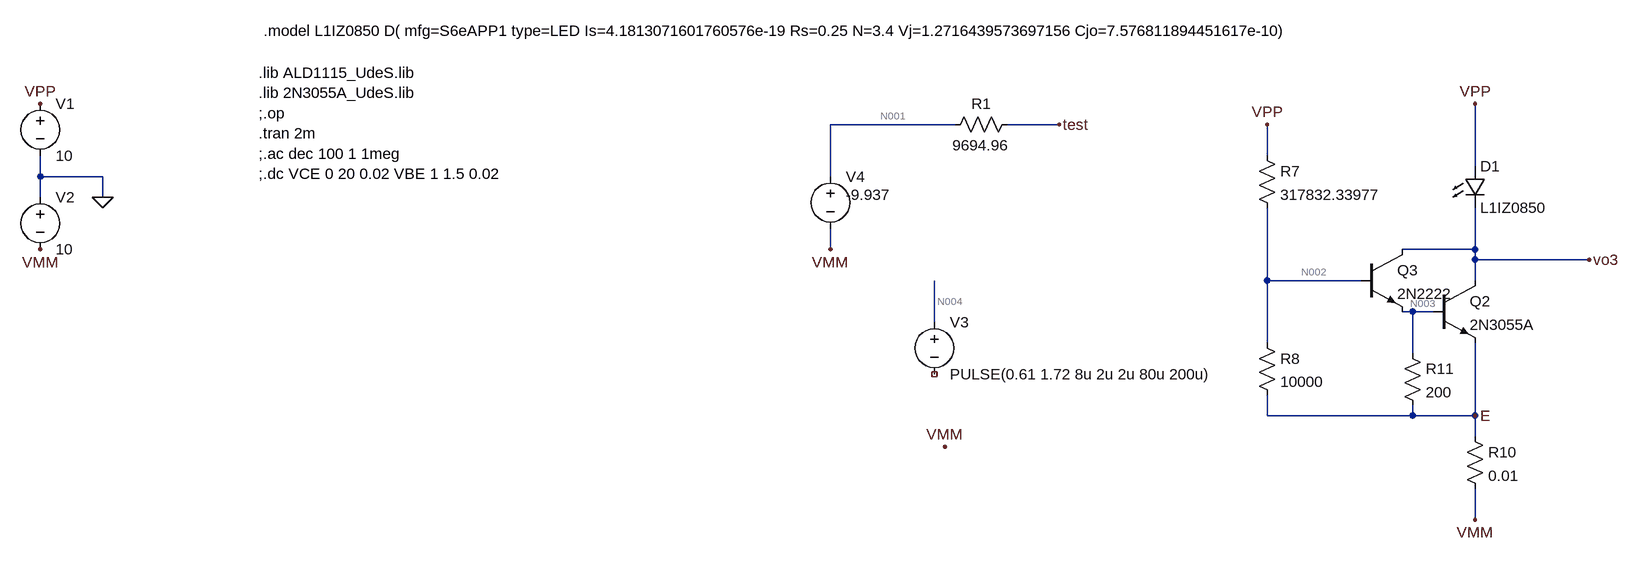
[diagram p0: schematic 3.asc]
3.asc, the LTspice schematic file:
Version 4
SHEET 1 2260 1556
WIRE 432 -16 240 -16
WIRE 592 -16 512 -16
WIRE 912 32 912 -16
WIRE 1232 48 1232 -48
WIRE -976 64 -976 32
WIRE -880 64 -976 64
WIRE 240 64 240 -16
WIRE -976 96 -976 64
WIRE -880 96 -880 64
WIRE 240 176 240 144
WIRE 1232 176 1232 112
WIRE 1232 176 1120 176
WIRE 1232 192 1232 176
WIRE 1408 192 1232 192
WIRE 912 224 912 112
WIRE 1056 224 912 224
WIRE 1232 224 1232 192
WIRE 1136 272 1120 272
WIRE 1168 272 1136 272
WIRE 400 288 400 224
WIRE 912 320 912 224
WIRE 1136 336 1136 272
WIRE 912 432 912 400
WIRE 1136 432 1136 416
WIRE 1136 432 912 432
WIRE 1232 432 1232 320
WIRE 1232 432 1136 432
WIRE 1232 464 1232 432
WIRE 1232 592 1232 544
FLAG -976 -48 VPP
FLAG -976 176 VMM
FLAG -880 96 0
FLAG 1232 -48 VPP
FLAG 1232 592 VMM
FLAG 1408 192 vo3
FLAG 1232 432 E
FLAG 912 -16 VPP
FLAG 416 480 VMM
FLAG 592 -16 test
FLAG 240 176 VMM
SYMBOL /voltage -976 -64 R0
WINDOW 123 0 0 Left 0
WINDOW 39 0 0 Left 0
SYMATTR InstName V1
SYMATTR Value 10
SYMBOL /voltage -976 80 R0
WINDOW 123 0 0 Left 0
WINDOW 39 0 0 Left 0
SYMATTR InstName V2
SYMATTR Value 10
SYMBOL /res 1216 448 R0
SYMATTR InstName R10
SYMATTR Value 0.01
SYMBOL LED 1216 48 R0
SYMATTR InstName D1
SYMATTR Value L1IZ0850
SYMBOL npn 1168 224 R0
SYMATTR InstName Q2
SYMATTR Value 2N3055A
SYMBOL /npn 1056 176 R0
SYMATTR InstName Q3
SYMATTR Value 2N2222
SYMBOL res 1120 320 R0
SYMATTR InstName R11
SYMATTR Value 200
SYMBOL res 896 16 R0
SYMATTR InstName R7
SYMATTR Value 317832.33977
SYMBOL res 896 304 R0
SYMATTR InstName R8
SYMATTR Value 10000
SYMBOL /voltage 400 272 R0
WINDOW 123 0 0 Left 0
WINDOW 39 0 0 Left 0
SYMATTR InstName V3
SYMATTR Value PULSE(0.61 1.72 8u 2u 2u 80u 200u)
SYMBOL /voltage 240 48 R0
WINDOW 123 0 0 Left 0
WINDOW 39 0 0 Left 0
WINDOW 3 24 44 Left 2
SYMATTR InstName V4
SYMATTR Value -9.937
SYMBOL res 528 -32 R90
WINDOW 0 0 56 VBottom 2
WINDOW 3 32 56 VTop 2
SYMATTR InstName R1
SYMATTR Value 9694.96
TEXT -640 -96 Left 2 !.lib ALD1115_UdeS.lib\n.lib 2N3055A_UdeS.lib\n;.op\n.tran 2m\n;.ac dec 100 1 1meg\n;.dc VCE 0 20 0.02 VBE 1 1.5 0.02
TEXT -632 -160 Left 2 !.model L1IZ0850 D( mfg=S6eAPP1 type=LED Is=4.1813071601760576e-19 Rs=0.25 N=3.4 Vj=1.2716439573697156 Cjo=7.576811894451617e-10)

The netlist it stands for:
* 3.asc
V1 VPP 0 10
V2 0 VMM 10
R10 E VMM 0.01
D1 VPP vo3 L1IZ0850
Q2 vo3 N003 E 0 2N3055A
Q3 vo3 N002 N003 0 2N2222
R11 N003 E 200
R7 VPP N002 317832.33977
R8 N002 E 10000
V3 N004 NC_01 PULSE(0.61 1.72 8u 2u 2u 80u 200u)
V4 N001 VMM -9.937
R1 test N001 9694.96
.model D D
.lib standard.dio
.model NPN NPN
.model PNP PNP
.lib standard.bjt
.lib ALD1115_UdeS.lib
.lib 2N3055A_UdeS.lib
;.op
.tran 2m
;.ac dec 100 1 1meg
;.dc VCE 0 20 0.02 VBE 1 1.5 0.02
.model L1IZ0850 D( mfg=S6eAPP1 type=LED Is=4.1813071601760576e-19 Rs=0.25 N=3.4 Vj=1.2716439573697156 Cjo=7.576811894451617e-10)
.backanno
.end

* Results of the author's LTspice run, read from the files saved beside the schematic
* Operating Point, zero values left out:
*   V(vpp) = 10 V
*   V(vmm) = -10 V
*   V(e) = -10 V
*   V(vo3) = 7.099 V
*   V(n003) = -9.982 V
*   V(n002) = -9.394 V
*   V(n004) = 610 mV
*   V(n001) = -19.94 V
*   V(test) = -19.94 V
*   Ic(Q3) = 88.73 µA
*   Ib(Q3) = 380.9 nA
*   Ie(Q3) = -89.11 µA
*   Ic(Q2) = 5.032 nA
*   Ib(Q2) = -5 nA
*   Ie(Q2) = -32.01 pA
*   I(D1) = 88.74 µA
*   I(R8) = 60.64 µA
*   I(R7) = 61.02 µA
*   I(R11) = 89.12 µA
*   I(R10) = 149.8 µA
*   I(V2) = -149.8 µA
*   I(V1) = -149.8 µA
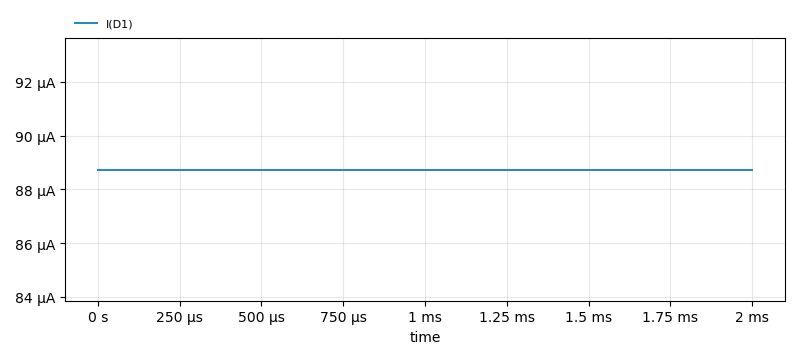
[diagram p1: Transient Analysis of 3.asc, plotted from the saved traces]
* Transient Analysis, 1 run:
*   I(D1): min 88.74 µA, max 88.74 µA, average 88.74 µA, rms 88.74 µA, last 88.74 µA